# EAGLE design untitled (EAGLE 7.2.0)
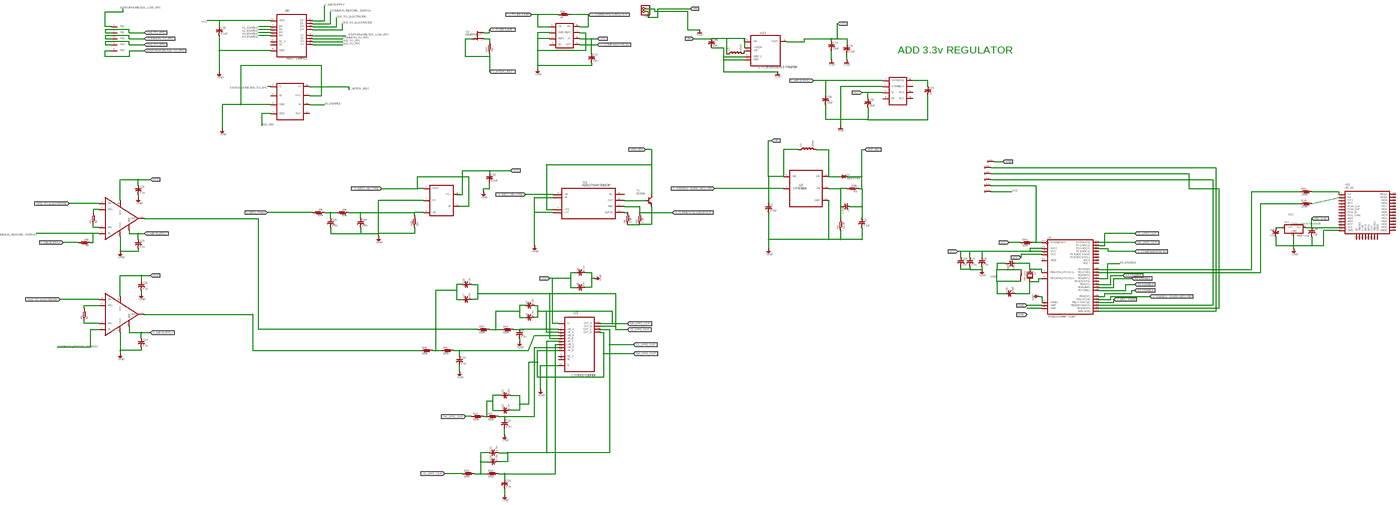
[diagram p0: schematic, sheet 1, overview]
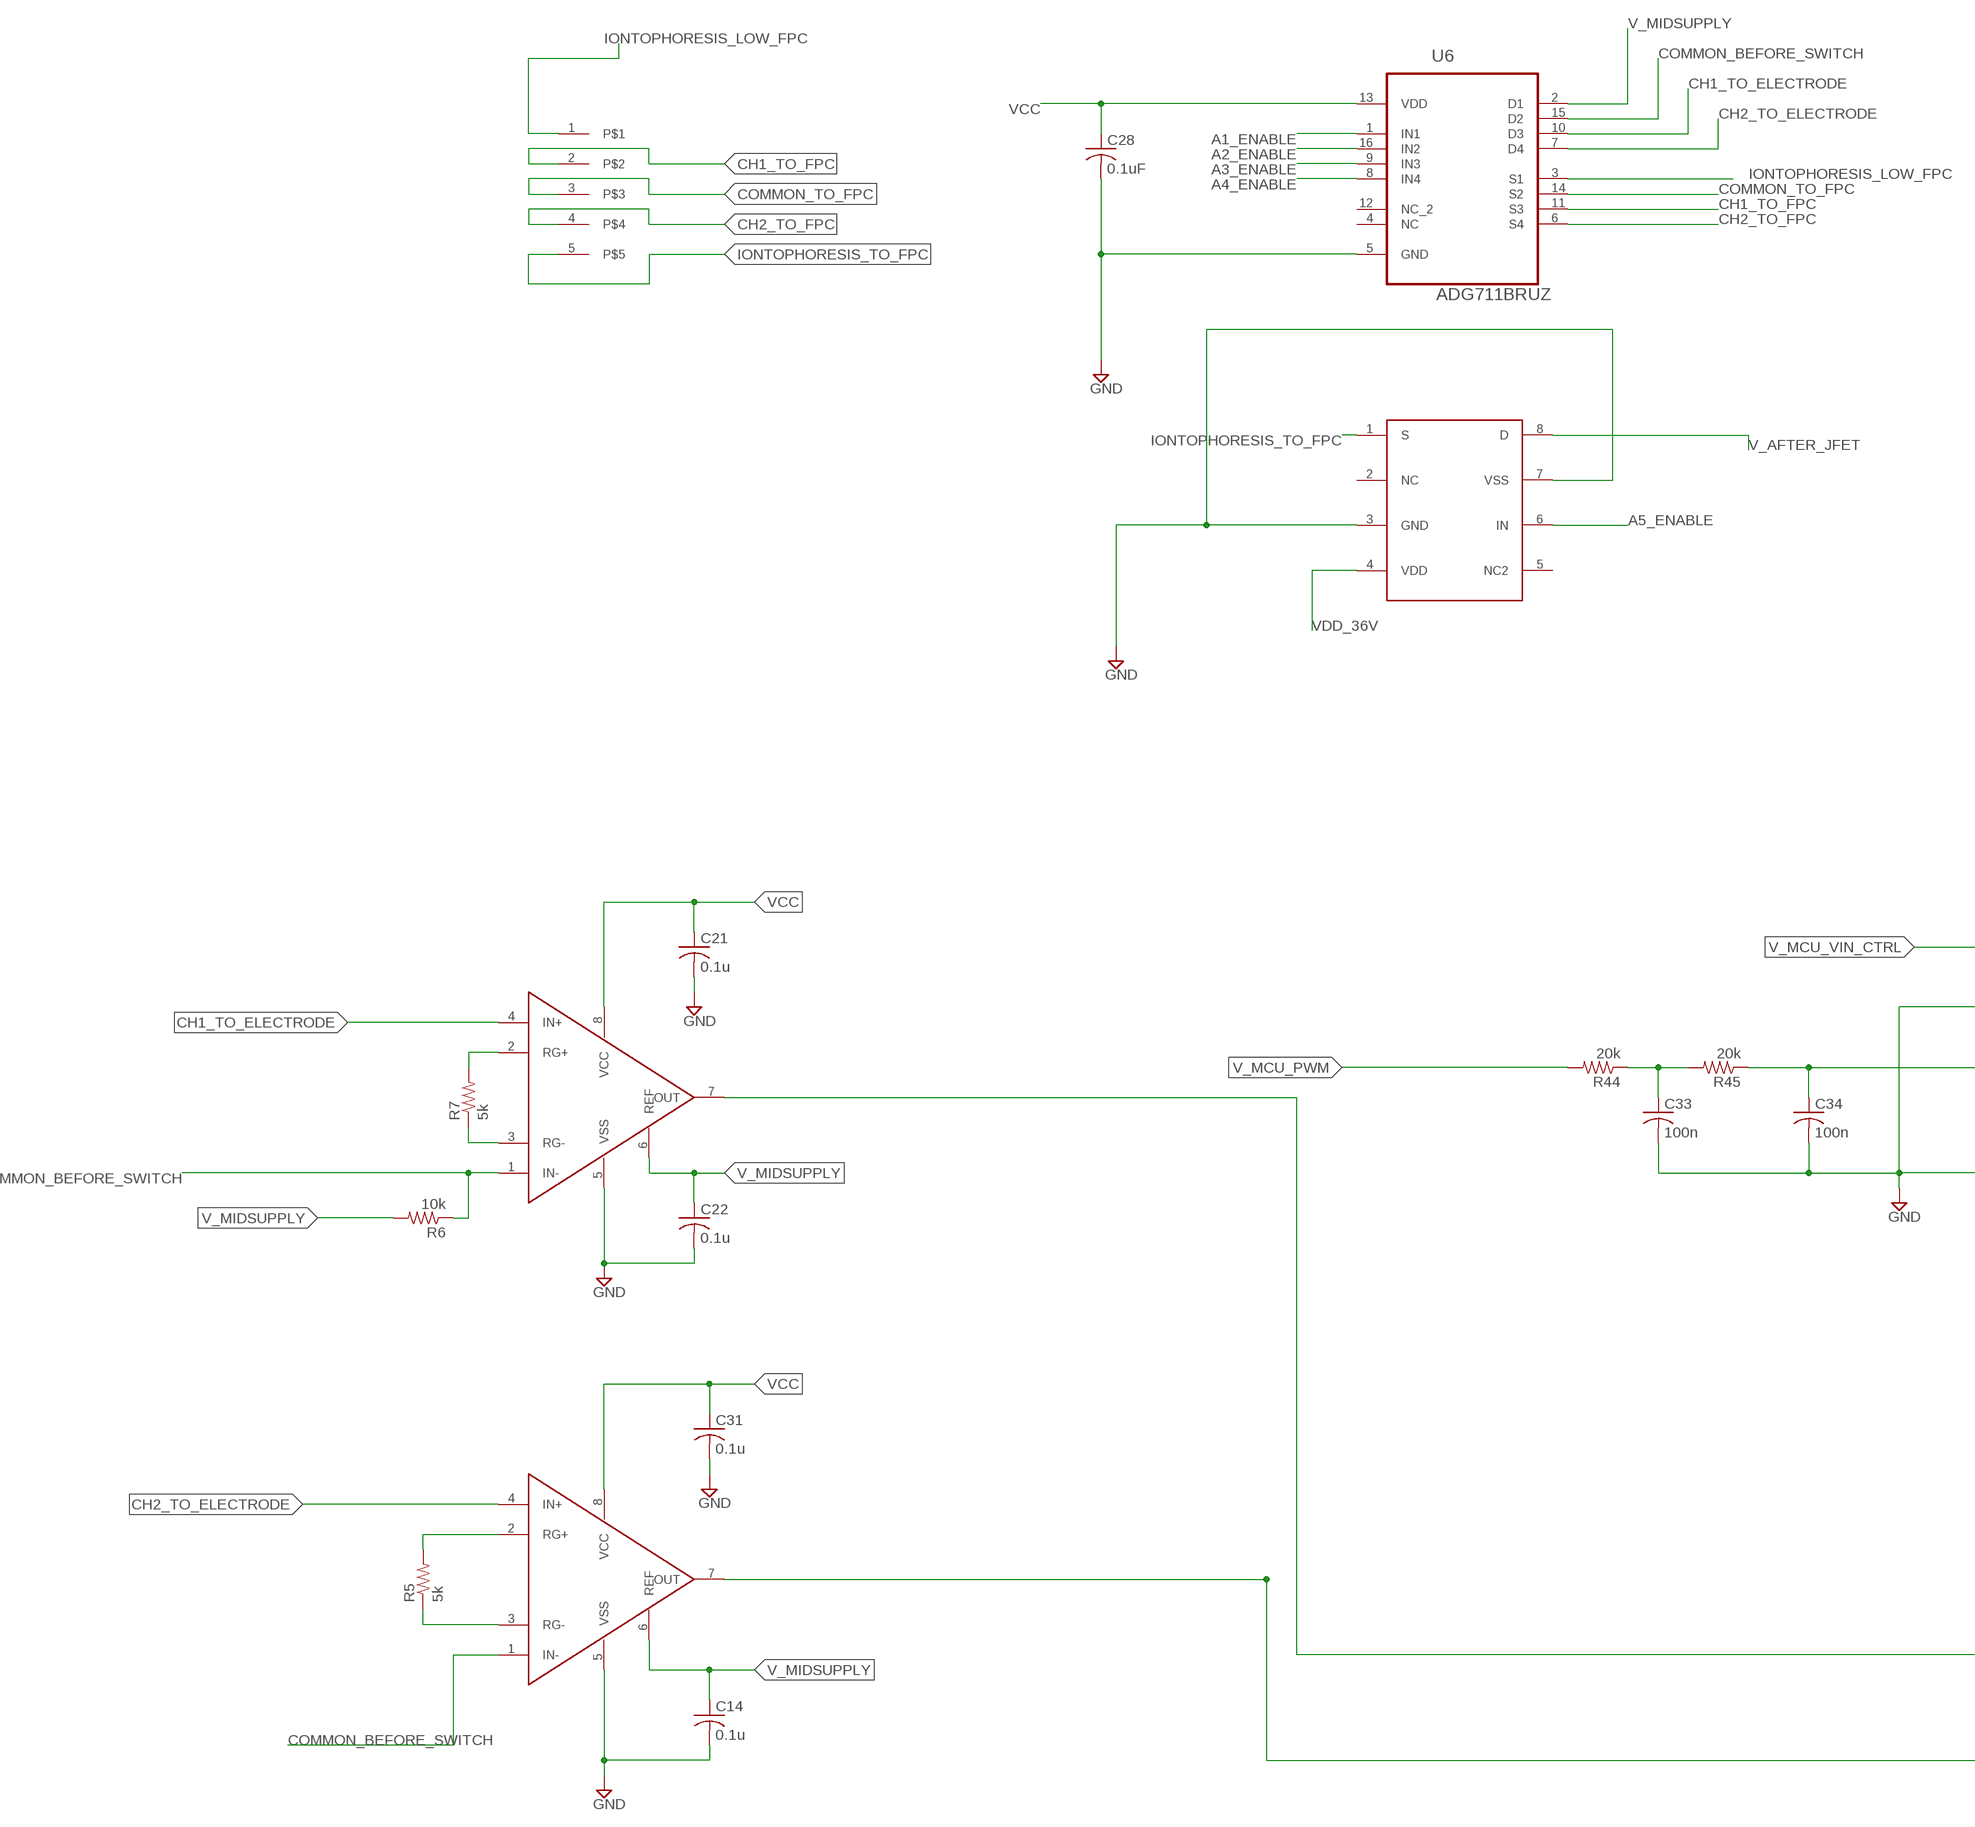
[diagram p1: schematic, sheet 1, part 1 of 4]
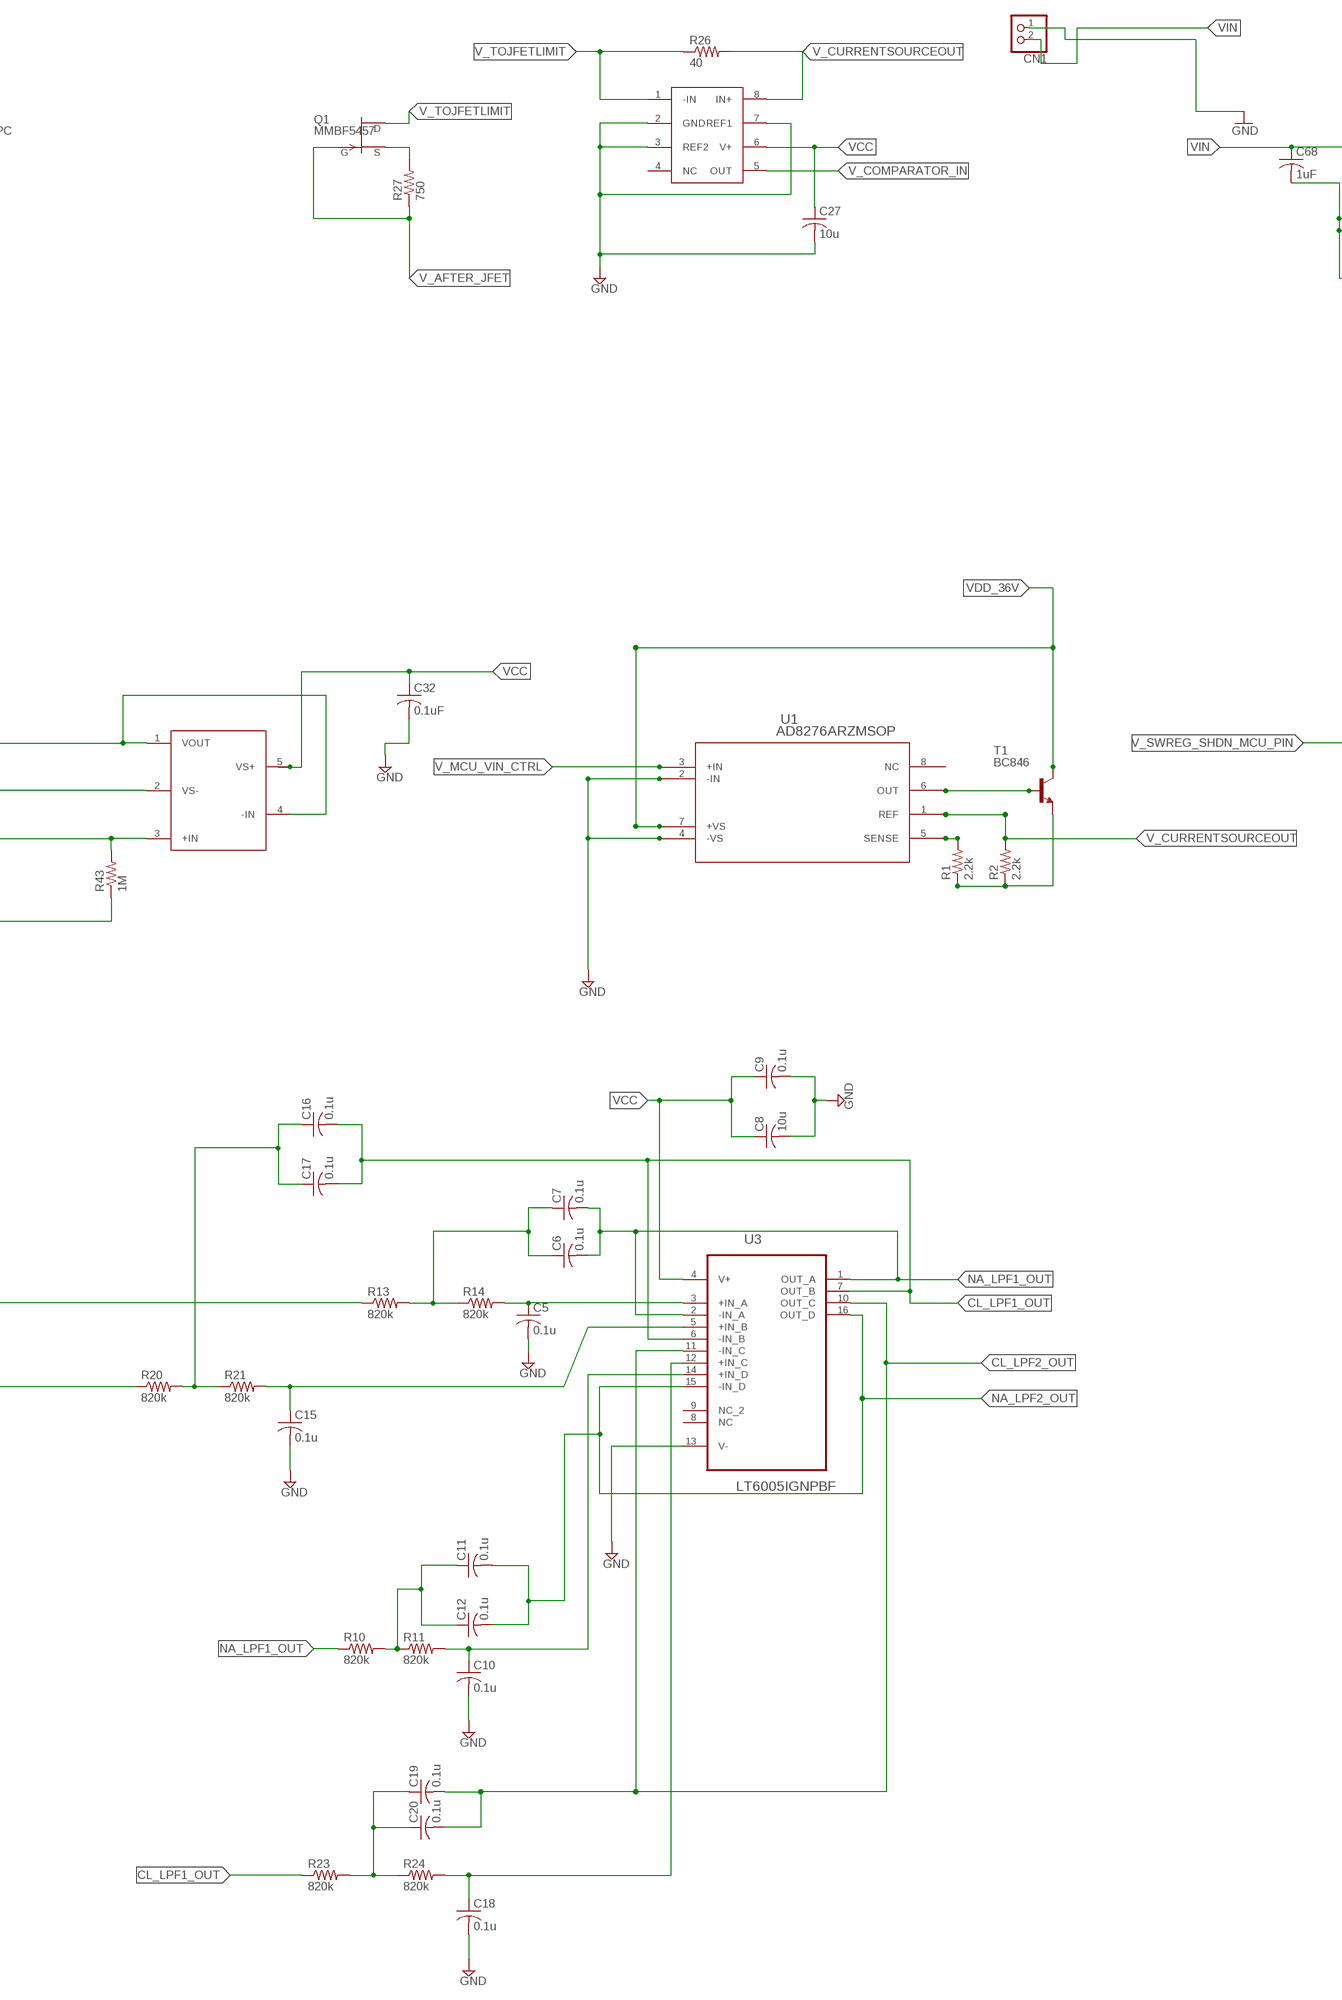
[diagram p2: schematic, sheet 1, part 2 of 4]
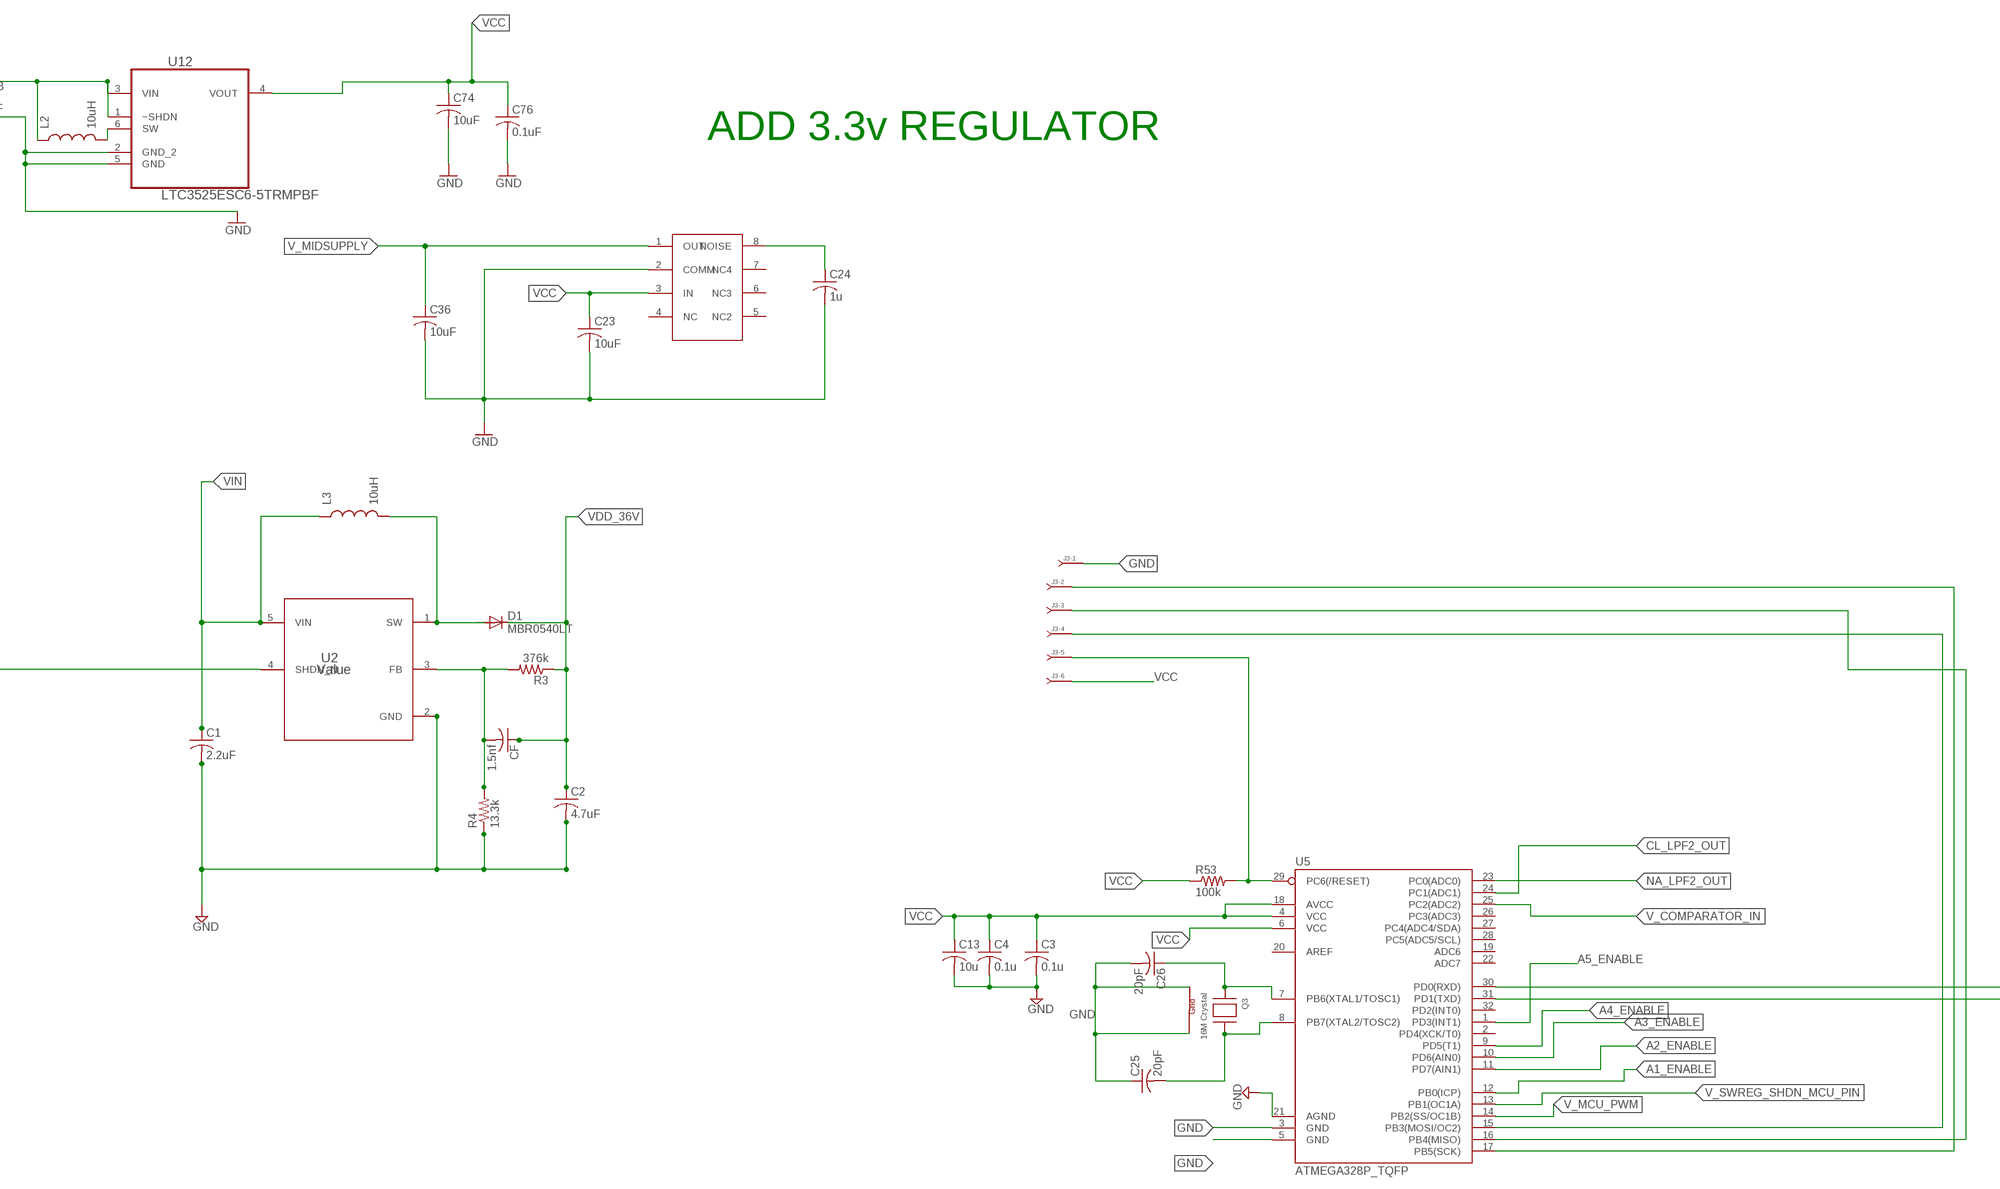
[diagram p3: schematic, sheet 1, part 3 of 4]
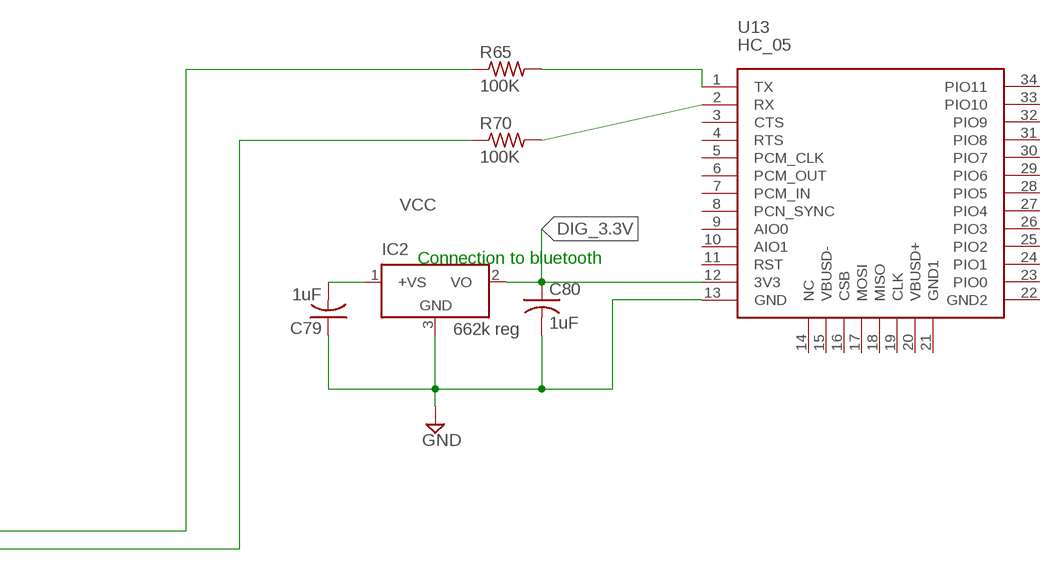
[diagram p4: schematic, sheet 1, part 4 of 4]

## Parts
C1  2.2uF  C-USC0402  [C0402]
C2  4.7uF  C-USC0603  [C0603]
C3  0.1u  C-USC0201  [C0201]
C4  0.1u  C-USC0201  [C0201]
C5  0.1u  C-USC0201  [C0201]
C6  0.1u  C-USC0201  [C0201]
C7  0.1u  C-USC0201  [C0201]
C8  10u  C-USC0402  [C0402]
C9  0.1u  C-USC0201  [C0201]
C10  0.1u  C-USC0201  [C0201]
C11  0.1u  C-USC0201  [C0201]
C12  0.1u  C-USC0201  [C0201]
C13  10u  C-USC0402  [C0402]
C14  0.1u  C-USC0201  [C0201]
C15  0.1u  C-USC0201  [C0201]
C16  0.1u  C-USC0201  [C0201]
C17  0.1u  C-USC0201  [C0201]
C18  0.1u  C-USC0201  [C0201]
C19  0.1u  C-USC0201  [C0201]
C20  0.1u  C-USC0201  [C0201]
C21  0.1u  C-USC0201  [C0201]
C22  0.1u  C-USC0201  [C0201]
C23  10uF  C-USC0402  [C0402]
C24  1u  C-USC0402  [C0402]
C25  20pF  C-USC0402  [C0402]
C26  20pF  C-USC0402  [C0402]
C27  10u  C-USC0402  [C0402]
C28  0.1uF  C-USC0201  [C0201]
C31  0.1u  C-USC0201  [C0201]
C32  0.1uF  C-USC0201  [C0201]
C33  100n  C-USC0201  [C0201]
C34  100n  C-USC0201  [C0201]
C36  10uF  C-USC0402  [C0402]
C68  1uF  C-USC0402  [C0402]
C74  10uF  C-USC0402  [C0402]
C76  0.1uF  C-USC0402  [C0402]
C79  1uF  C-USC0402  [C0402]
C80  1uF  C-USC0402  [C0402]
CF  1.5nf  C-USC0402  [C0402]
CN1  JST_2PIN-SMT  [JST-PH-2-SMT]
D1  MBR0540LT  [SOD123]
IC2  662k reg  LM50  [SOT23]
J3  J-06-100-2X03  [HDR-100-2X03]
L2  10uH  INDUCTOR0805  [0805]
L3  10uH  INDUCTOR0805  [0805]
Q1  MMBF5457  [SOT23]
Q3  16M Crystal  XTAL-4-3225  [NX3225]
R1  2.2k  R-US_R0201  [R0201]
R2  2.2k  R-US_R0201  [R0201]
R3  376k  R-US_R0402  [R0402]
R4  13.3k  R-US_R0402  [R0402]
R5  5k  R-US_R0201  [R0201]
R6  10k  R-US_R0201  [R0201]
R7  5k  R-US_R0201  [R0201]
R10  820k  R-US_R0201  [R0201]
R11  820k  R-US_R0201  [R0201]
R13  820k  R-US_R0201  [R0201]
R14  820k  R-US_R0201  [R0201]
R20  820k  R-US_R0201  [R0201]
R21  820k  R-US_R0201  [R0201]
R23  820k  R-US_R0201  [R0201]
R24  820k  R-US_R0201  [R0201]
R26  40  R-US_R0201  [R0201]
R27  750  R-US_R0402  [R0402]
R43  1M  R-US_R0201  [R0201]
R44  20k  R-US_R0201  [R0201]
R45  20k  R-US_R0201  [R0201]
R53  100k  R-US_R0201  [R0201]
R65  100K  R-US_R0201  [R0201]
R70  100K  R-US_R0201  [R0201]
T1  BC846  [SOT23]
U1  AD8276ARZMSOP  [MSOP08]
U2  Value  LMR64010XMFE/NOPB  [DBV0005A_N]
U3  LT6005IGNPBF  [SOP63P600X175-16N]
U4  INA282  [SO08]
U5  ATMEGA328P_TQFP  [TQFP32-08]
U6  ADG711BRUZ  [SOP65P640X120-16N]
U7  SOIC8_INAMPMSOP  [MSOP08]
U8  SOIC8_INAMPMSOP  [MSOP08]
U12  LTC3525ESC6-5TRMPBF  [SOT65P210X100-6N]
U13  HC_05  [BLUETOOTH_SMD]
U15  TLE2426IDR  [R_8]
U20  FH12-5S-1SH  [FH12-5S-1SH]
U$1  ADG5401  [MSOP08]
U$5  LT1800  [SOT23-5]

## Nets
A1_ENABLE: U5.12(PB0(ICP)) U6.1(IN1)
A2_ENABLE: U5.11(PD7(AIN1)) U6.16(IN2)
A3_ENABLE: U5.10(PD6(AIN0)) U6.9(IN3)
A4_ENABLE: U5.9(PD5(T1)) U6.8(IN4)
A5_ENABLE: U5.1(PD3(INT1)) U$1.6(IN)
CH1_TO_ELECTRODE: U6.10(D3) U7.4(IN+)
CH1_TO_FPC: U6.11(S3) U20.2
CH2_TO_ELECTRODE: U6.7(D4) U8.4(IN+)
CH2_TO_FPC: U6.6(S4) U20.4
CL_LPF1_OUT: C16.2 C17.2 R23.1 U3.6(-IN_B) U3.7(OUT_B)
CL_LPF2_OUT: C19.2 C20.2 U3.10(OUT_C) U3.11(-IN_C) U5.24(PC1(ADC1))
COMMON_BEFORE_SWITCH: R6.1 U6.15(D2) U7.1(IN-) U8.1(IN-)
COMMON_TO_FPC: U6.14(S2) U20.3
DIG_3.3V: C80.1 IC2.2(VO) U13.12(3V3)
GND: C1.2 C2.2 C3.2 C4.2 C5.2 C8.2 C9.2 C10.2 C13.2 C14.2 C15.2 C18.2 C21.2 C22.2 C23.2 C24.2 C25.1 C26.2 C27.2 C28.2 C31.2 C32.2 C33.2 C34.2 C36.2 C68.2 C74.2 C76.2 C79.1 C80.2 CN1.1 IC2.3(GND) J3.1 Q3.2(G2) Q3.4(G1) R4.1 R43.1 U1.2(-IN) U1.4(-VS) U2.2(GND) U3.13(V-) U4.2(GND) U4.3(REF2) U4.7(REF1) U5.3(GND) U5.5(GND) U5.21(AGND) U6.5(GND) U7.5(VSS) U8.5(VSS) U12.2(GND_2) U12.5(GND) U13.13(GND) U15.2(COMM) U$1.3(GND) U$1.7(VSS) U$5.2(VS-)
IONTOPHORESIS_LOW_FPC: U6.3(S1) U20.1
IONTOPHORESIS_TO_FPC: U20.5 U$1.1(S)
N$1: T1.1(B) U1.6(OUT)
N$2: R13.1 U7.7(OUT)
N$4: R1.2 U1.5(SENSE)
N$6: R1.1 R2.1 T1.2(E)
N$7: R20.1 U8.7(OUT)
N$8: R5.1 U8.3(RG-)
N$9: CF.2 R3.2 R4.2 U2.3(FB)
N$10: R5.2 U8.2(RG+)
N$11: R65.1 U5.30(PD0(RXD))
N$12: C10.1 R11.2 U3.14(+IN_D)
N$13: C5.1 R14.2 U3.3(+IN_A)
N$14: Q1.2(S) R27.2
N$15: C6.1 C7.1 R13.2 R14.1
N$17: C11.1 C12.1 R10.2 R11.1
N$18: R7.1 U7.3(RG-)
N$19: R7.2 U7.2(RG+)
N$23: C24.1 U15.8(NOISE)
N$24: C15.1 R21.2 U3.5(+IN_B)
N$25: C16.1 C17.1 R20.2 R21.1
N$26: C18.1 R24.2 U3.12(+IN_C)
N$27: C19.1 C20.1 R23.2 R24.1
N$28: J3.5 R53.2 U5.29(PC6(/RESET))
N$36: L2.2 U12.6(SW)
N$45: C25.2 Q3.3(X2) U5.8(PB7(XTAL2/TOSC2))
N$49: C34.1 R43.2 R45.1 U$5.3(+IN)
N$52: C33.1 R44.1 R45.2
N$56: C26.1 Q3.1(X1) U5.7(PB6(XTAL1/TOSC1))
N$60: R65.2 U13.1(TX)
N$66: J3.4 U5.15(PB3(MOSI/OC2))
N$67: J3.2 U5.17(PB5(SCK))
N$68: J3.3 U5.16(PB4(MISO))
N$72: R70.1 U5.31(PD1(TXD))
N$97: R70.2 U13.2(RX)
NA_LPF1_OUT: C6.2 C7.2 R10.1 U3.1(OUT_A) U3.2(-IN_A)
NA_LPF2_OUT: C11.2 C12.2 U3.15(-IN_D) U3.16(OUT_D) U5.23(PC0(ADC0))
PIN1: D1.A L3.2 U2.1(SW)
V_AFTER_JFET: Q1.3(G) R27.1 U$1.8(D)
V_COMPARATOR_IN: U4.5(OUT) U5.25(PC2(ADC2))
V_CURRENTSOURCEOUT: R2.2 R26.2 U1.1(REF) U4.8(IN+)
V_MCU_PWM: R44.2 U5.14(PB2(SS/OC1B))
V_MCU_VIN_CTRL: U1.3(+IN) U$5.1(VOUT) U$5.4(-IN)
V_MIDSUPPLY: C14.1 C22.1 C36.1 R6.2 U6.2(D1) U7.6(REF) U8.6(REF) U15.1(OUT)
V_SWREG_SHDN_MCU_PIN: U2.4(SHDN_N) U5.13(PB1(OC1A))
V_TOJFETLIMIT: Q1.1(D) R26.1 U4.1(-IN)
VCC: C3.1 C4.1 C8.1 C9.1 C13.1 C21.1 C23.1 C27.1 C28.1 C31.1 C32.1 C74.1 C76.1 C79.2 IC2.1(+VS) J3.6 R53.1 U3.4(V+) U4.6(V+) U5.4(VCC) U5.6(VCC) U5.18(AVCC) U6.13(VDD) U7.8(VCC) U8.8(VCC) U12.4(VOUT) U15.3(IN) U$5.5(VS+)
VDD_36V: C2.1 CF.1 D1.C R3.1 T1.3(C) U1.7(+VS) U$1.4(VDD)
VIN: C1.1 C68.1 CN1.2 L2.1 L3.1 U2.5(VIN) U12.1(~SHDN) U12.3(VIN)
Unconnected: U1.8(NC) U3.8(NC) U3.9(NC_2) U4.4(NC) U5.2(PD4(XCK/T0)) U5.19(ADC6) U5.20(AREF) U5.22(ADC7) U5.26(PC3(ADC3)) U5.27(PC4(ADC4/SDA)) U5.28(PC5(ADC5/SCL)) U5.32(PD2(INT0)) U6.4(NC) U6.12(NC_2) U13.3(CTS) U13.4(RTS) U13.5(PCM_CLK) U13.6(PCM_OUT) U13.7(PCM_IN) U13.8(PCN_SYNC) U13.9(AIO0) U13.10(AIO1) U13.11(RST) U13.14(NC) U13.15(VBUSD-) U13.16(CSB) U13.17(MOSI) U13.18(MISO) U13.19(CLK) U13.20(VBUSD+) U13.21(GND1) U13.22(GND2) U13.23(PIO0) U13.24(PIO1) U13.25(PIO2) U13.26(PIO3) U13.27(PIO4) U13.28(PIO5) U13.29(PIO6) U13.30(PIO7) U13.31(PIO8) U13.32(PIO9) U13.33(PIO10) U13.34(PIO11) U15.4(NC) U15.5(NC2) U15.6(NC3) U15.7(NC4) U$1.2(NC) U$1.5(NC2)

## Notes on the sheet
- ADD 3.3v REGULATOR
- Connection to bluetooth

## Library data of the parts
C1-C22 C27 C28 C31-C34 CF = resistor:C-US: CAPACITOR, American symbol
C23-C26 C36 C74 C76 = adafruit:C-US: CAPACITOR, American symbol; OC_NEWARK: unknown
C68 C79 C80 = adafruit:C-US: CAPACITOR, American symbol; MPN: MC0402X105M6R3CT; OC_NEWARK: 06R4879
CN1 = adafruit:JST_2PIN: JST 2-Pin Connectors of various flavors SMT-RA (S2B-PH-SM4) 4UConnector #17311 SMT (B2B-PH-SM4) THM-RA (S2B-PH) THM (B2B-PH)
D1 = eric-custom:MBR0540LT: SCHOTTKY BARRIER RECTIFIER
IC2 = linear:LM50: SOT-23 Single-Supply Centigrade Temperature Sensor Vout = (10mV/°C x Temp °C) +5mmmV Source: http://cache.national.com/ds/LM/LM50.pdf; MF: NATIONAL SEMICONDUCTOR; MPN: LM5008MM/NOPB; OC_NEWARK: 41K6028
J3 = con-headers-jp:J-06-: HEADER JACK PINS
L2 L3 = SparkFun-Passives:INDUCTOR: Inductors Basic Inductor/Choke - 0603 and 1206. Footprints are not proven and vary greatly between part numbers. SRN6045- 33uH, 20% 1.4A SDR0403-560KL - 56uH, 10%, 500mA RMS/740mA peak; OC_NEWARK: unknown
Q1 = eric-custom:MMBF5457: MMBF5457 N-JFET
Q3 = adafruit:XTAL-4: Classic 4-pin 3.2 x 2.5mm crystal; OC_NEWARK: unknown
R1-R7 R10 R11 R13 R14 R20 R21 R23 R24 R26 R27 R43-R45 = resistor:R-US_: RESISTOR, American symbol
R53 R65 R70 = resistor:R-US_: RESISTOR, American symbol; OC_NEWARK: unknown
T1 = transistor:BC846: NPN TRANSISTOR
U1 = eric-custom:AD8276ARZ
U2 = eric-custom:LMR64010XMFE/NOPB; COMPTYPE: IC; MANUFACTURER: Texas Instruments; MOUNTTYPE: SMT; PACKAGEREFERENCE: DBV0005A; PARTNUMBER: LMR64010XMFE/NOPB; PIN_COUNT: 5; REFDES: RefDes; ROHS: Y; TYPE: TYPE
U3 = LTC_By_element14_Batch_1:LT6005IGNPBF: Op Amps; MPN: LT6005IGN#PBF; OC_FARNELL: 1432099; OC_NEWARK: 57M8943; PACKAGE: SSOP-16; SUPPLIER: Linear Technology
U4 = eric-custom:INA282
U5 = SparkFun-DigitalIC:ATMEGA328P_TQFP; PROD_ID: IC-09069
U6 = Analog Devices_By_element14_Batch_1:ADG711BRUZ: CMOS Low Voltage 4Quad SPST Switches; MPN: ADG711BRUZ; OC_FARNELL: 1838886; OC_NEWARK: 19M8667; PACKAGE: TSSOP-16; SUPPLIER: Analog Devices
U7 U8 = eric-custom:SOIC8_INAMP: Generic single supply instrumentation amplifier for SO8 package. Based off of AD8221 inamp package
U12 = LTC_By_element14_Batch_1:LTC3525ESC6-5TRMPBF: Step-Up DC/DC Converter; OC_FARNELL: 1663905; OC_NEWARK: unknown; PACKAGE: SC70-6; SUPPLIER: LINEAR TECHNOLOGY
U13 = Bluetooth HC-05:HC_05: HC-05 Bluetooth Module; OC_NEWARK: unknown
U15 = eric-custom:TLE2426IDR: TLE2426 Rail splitter
U20 = eric-custom:FH12-5S-1SH: 1mm pitch FPC connector, 5pin
U$1 = eric-custom:ADG5401
U$5 = eric-custom:LT1800: 80MHz, 25V/µs Low Power Rail-to-Rail Input and Output Precision Op Amp

## Board
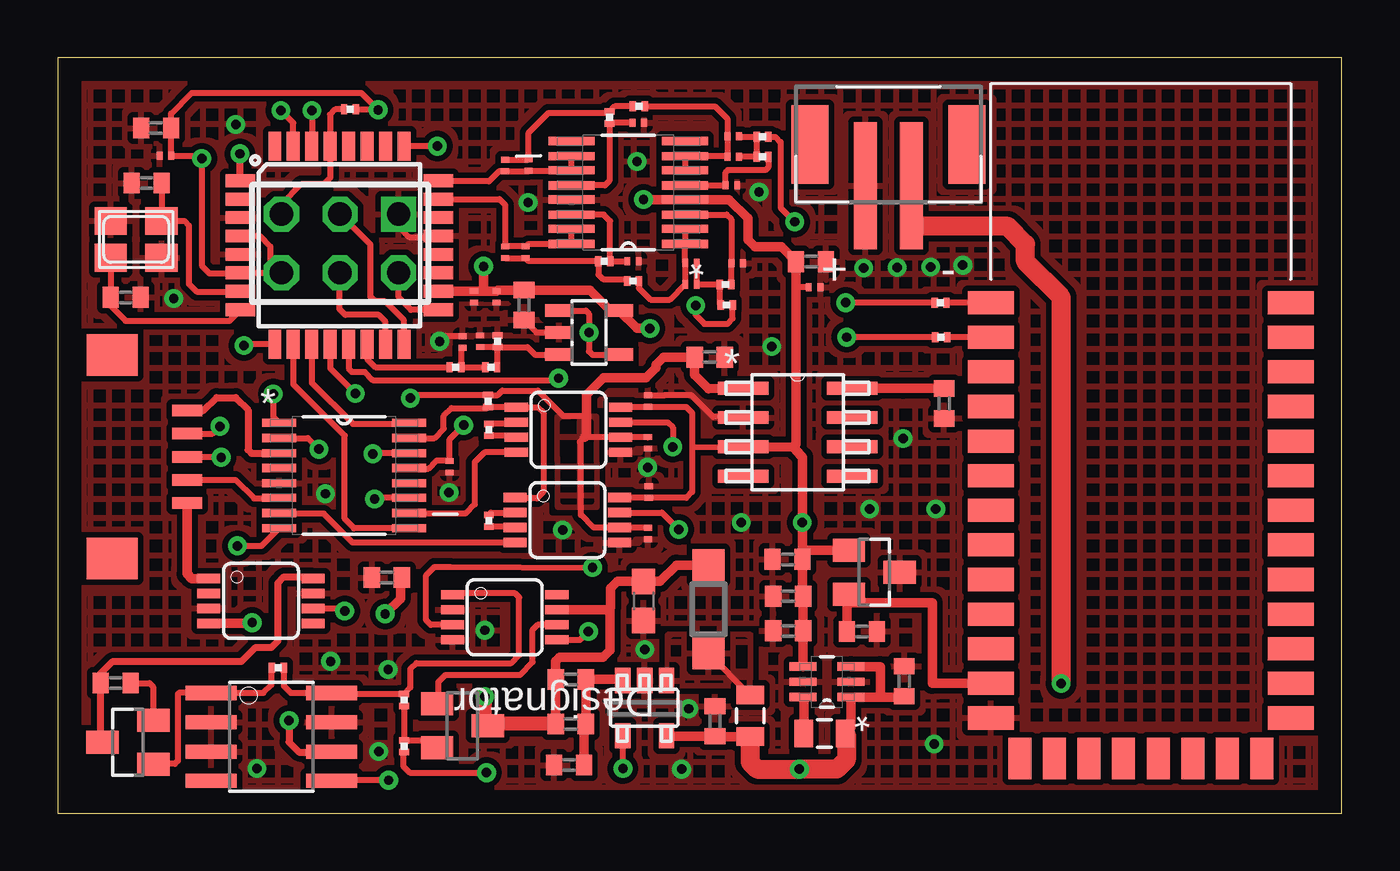
[diagram p5: board, top side]
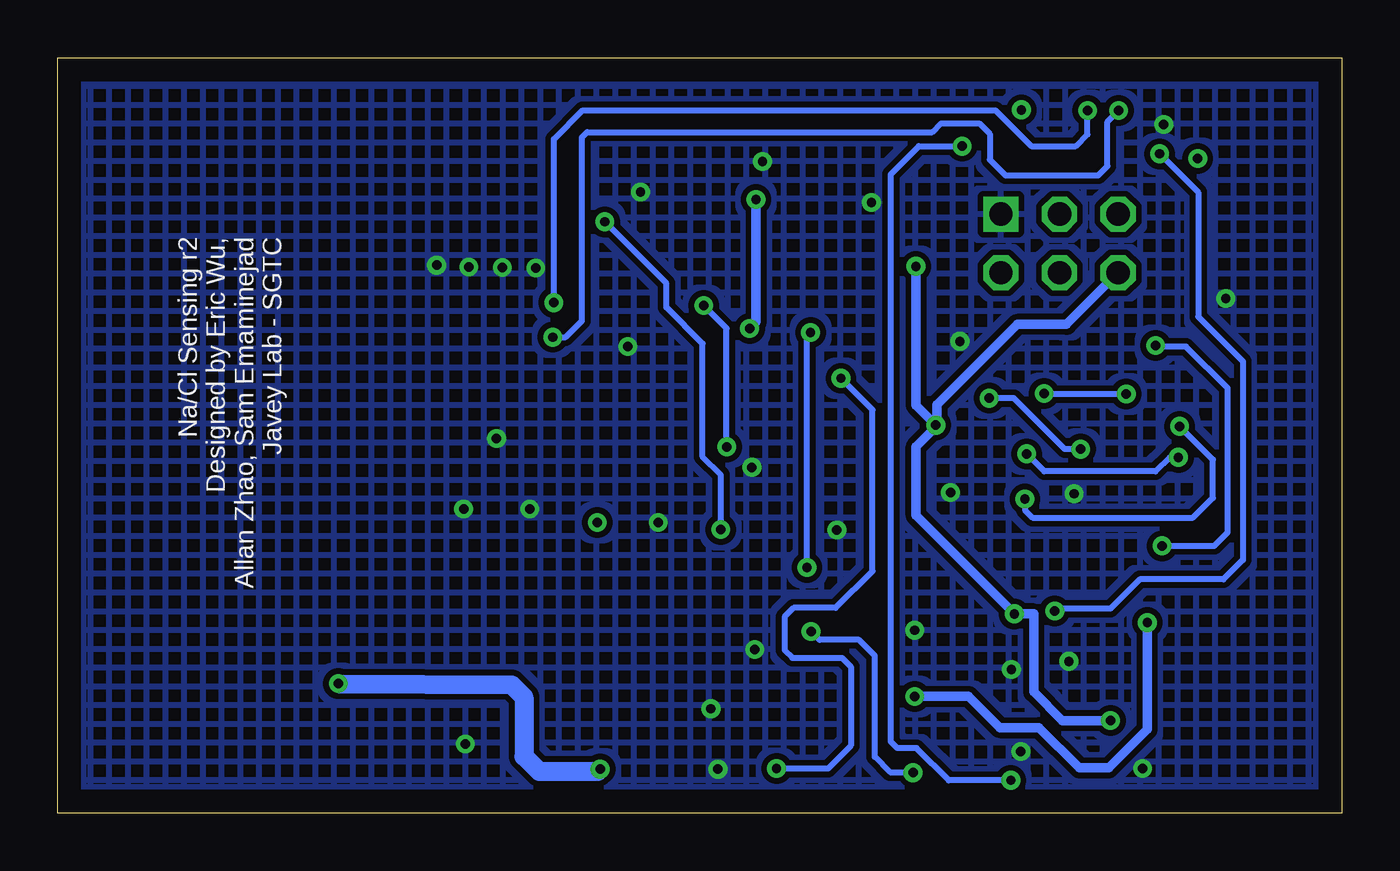
[diagram p6: board, bottom side, seen from below]

Size 55.68 x 32.74 mm. Coordinates in mm from the lower left corner, seen from the top.
Outline: 0,0 55.68,0 55.68,32.74 0,32.74 0,0
Copper layers (1*16): Top 0.035mm / dielectric 1.5mm / Bottom 0.035mm
Design rules "default *": minimum track width 10mil, minimum drill 15mil, track to track 8mil, track to pad 8mil, pad to pad 8mil, via to via 8mil, smd to smd 8mil, copper to edge 40mil, drill to drill 8mil, minimum pad ring 10mil, minimum via ring 8mil, stop-mask expansion 4mil, vias tented up to drill 0mil, thermal gap 10mil

### Footprints (pad centres in the part's own frame; a part is rotated, then mirrored left to right if it is on the bottom)
C0402 = smd 0.7 x 0.9: 1 -0.65,0; 2 0.65,0
C0603 = smd 1.1 x 1: 1 -0.85,0; 2 0.85,0
C0201 = smd 0.25 x 0.35: 1 -0.25,0; 2 0.25,0
JST-PH-2-SMT = smd 1 x 5.5: 1 -1,-1.8; 2 1,-1.8 | smd 1.6 x 3.4: NC1 -3.4,0; NC2 3.4,0
SOD123 = smd 1.4 x 1.4: A 1.9,0; C -1.9,0
SOT23 = smd 1 x 1.4: 1 -0.95,-1.1; 2 0.95,-1.1; 3 0,1.1
HDR-100-2X03 = drill 1.016 square: 1 -2.54,-1.27 | drill 1.016 octagon: 2 -2.54,1.27; 3 0,-1.27; 4 0,1.27; 5 2.54,-1.27; 6 2.54,1.27
0805 = smd 0.8 x 1.2: 1 -0.9,0; 2 0.9,0
NX3225 = smd 1.4 x 1.2: 1 -1.1,-0.8; 2 1.1,-0.8; 3 1.1,0.8; 4 -1.1,0.8
R0201 = smd 0.28 x 0.43: 1 -0.255,0; 2 0.255,0
R0402 = smd 0.7 x 0.9: 1 -0.65,0; 2 0.65,0
MSOP08 = smd 0.4 x 1: 1 -0.976,-2.263; 2 -0.326,-2.263; 3 0.324,-2.263; 4 0.974,-2.263; 5 0.974,2.262; 6 0.324,2.262; 7 -0.326,2.262; 8 -0.976,2.262
DBV0005A_N = smd 1.092 x 0.66: 1 -1.2,0.95; 2 -1.2,0; 3 -1.2,-0.95; 4 1.2,-0.95; 5 1.2,0.95
SOP63P600X175-16N = smd 1.981 x 0.356: 1 -2.464,2.235; 2 -2.464,1.575; 3 -2.464,0.965; 4 -2.464,0.305; 5 -2.464,-0.305; 6 -2.464,-0.965; 7 -2.464,-1.575; 8 -2.464,-2.235; 9 2.464,-2.235; 10 2.464,-1.575; 11 2.464,-0.965; 12 2.464,-0.305; 13 2.464,0.305; 14 2.464,0.965; 15 2.464,1.575; 16 2.464,2.235
SO08 = smd 0.61 x 2.21: 1 -1.905,-2.616; 2 -0.635,-2.616; 3 0.635,-2.616; 4 1.905,-2.616; 5 1.905,2.616; 6 0.635,2.616; 7 -0.635,2.616; 8 -1.905,2.616
TQFP32-08 = smd 1.27 x 0.559: 1 -4.293,2.8; 2 -4.293,2; 3 -4.293,1.2; 4 -4.293,0.4; 5 -4.293,-0.4; 6 -4.293,-1.2; 7 -4.293,-2; 8 -4.293,-2.8; 17 4.293,-2.8; 18 4.293,-2; 19 4.293,-1.2; 20 4.293,-0.4; 21 4.293,0.4; 22 4.293,1.2; 23 4.293,2; 24 4.293,2.8 | smd 0.559 x 1.27: 9 -2.8,-4.293; 10 -2,-4.293; 11 -1.2,-4.293; 12 -0.4,-4.293; 13 0.4,-4.293; 14 1.2,-4.293; 15 2,-4.293; 16 2.8,-4.293; 25 2.8,4.293; 26 2,4.293; 27 1.2,4.293; 28 0.4,4.293; 29 -0.4,4.293; 30 -1.2,4.293; 31 -2,4.293; 32 -2.8,4.293
SOP65P640X120-16N = smd 1.473 x 0.356: 1 -2.819,2.286; 2 -2.819,1.626; 3 -2.819,0.965; 4 -2.819,0.33; 5 -2.819,-0.33; 6 -2.819,-0.965; 7 -2.819,-1.626; 8 -2.819,-2.286; 9 2.819,-2.286; 10 2.819,-1.626; 11 2.819,-0.965; 12 2.819,-0.33; 13 2.819,0.33; 14 2.819,0.965; 15 2.819,1.626; 16 2.819,2.286
SOT65P210X100-6N = smd 1.168 x 0.356: 1 -1.041,0.66; 2 -1.041,0; 3 -1.041,-0.66; 4 1.041,-0.66; 5 1.041,0; 6 1.041,0.66
BLUETOOTH_SMD = smd 2 x 1: 1 -6.35,3.81; 2 -6.35,2.31; 3 -6.35,0.81; 4 -6.35,-0.69; 5 -6.35,-2.19; 6 -6.35,-3.69; 7 -6.35,-5.19; 8 -6.35,-6.69; 9 -6.35,-8.19; 10 -6.35,-9.69; 11 -6.35,-11.19; 12 -6.35,-12.69; 13 -6.35,-14.19; 22 6.65,-14.19; 23 6.65,-12.69; 24 6.65,-11.19; 25 6.65,-9.69; 26 6.65,-8.19; 27 6.65,-6.69; 28 6.65,-5.19; 29 6.65,-3.69; 30 6.65,-2.19; 31 6.65,-0.69; 32 6.65,0.81; 33 6.65,2.31; 34 6.65,3.81 | smd 1 x 1.8: 14 -5.1,-15.94; 15 -3.6,-15.94; 16 -2.1,-15.94; 17 -0.6,-15.94; 18 0.9,-15.94; 19 2.4,-15.94; 20 3.9,-15.94; 21 5.4,-15.94
R_8 = smd 2.184 x 0.559: 1 -2.362,1.905; 2 -2.362,0.635; 3 -2.362,-0.635; 4 -2.362,-1.905; 5 2.362,-1.905; 6 2.362,-0.635; 7 2.362,0.635; 8 2.362,1.905
FH12-5S-1SH = smd 0.5 x 1.3: 1 2,-1.8; 2 1,-1.8; 3 0,-1.8; 4 -1,-1.8; 5 -2,-1.8 | smd 1.8 x 2.2: P$1 -4.41,1.45; P$2 4.41,1.45
SOT23-5 = smd 0.55 x 1.2: 1 -0.95,-1.3; 2 0,-1.3; 3 0.95,-1.3; 4 0.95,1.3; 5 -0.95,1.3

### Placement (x,y rotation side)
C1  28.5,3.99 90 top
C2  25.4,9.19 270 top
C3  19.02,22.38 270 top
C4  4.67,28.5 180 top
C5  29.46,23.83 0 top
C6  27.46,22.91 180 top
C7  27.46,23.85 180 top
C8  32.66,23.9 0 top
C9  32.82,22.78 0 top
C10  24.94,23.93 0 top
C11  20.29,24.31 90 top
C12  19.41,24.31 90 top
C13  4.27,29.69 180 top
C14  25.6,16.05 270 top
C15  29.21,27.2 0 top
C16  29.29,28.45 180 top
C17  29.29,29.34 180 top
C18  25.17,29.92 0 top
C19  19.41,28.07 270 top
C20  20.42,28.09 270 top
C21  25.63,13.92 90 top
C22  25.6,12.12 270 top
C23  20.22,22.02 270 top
C24  38.43,17.75 270 top
C25  2.95,22.35 180 top
C26  3.86,27.3 180 top
C27  14.27,10.21 180 top
C28  16.99,15.01 270 top
C31  25.6,17.86 90 top
C32  18.06,22.38 270 top
C33  17.55,20.42 90 top
C34  18.31,20.45 90 top
C36  28.27,19.76 0 top
C68  36.7,5.71 90 top
C74  31.67,9.4 180 top
C76  31.67,7.9 180 top
C79  31.65,11 0 top
C80  34.87,7.87 0 top
CF  22.25,3.86 0 top
CN1  36.02,28.98 0 top
D1  28.22,8.84 270 top
IC2  35.41,10.44 270 top
J3  12.24,24.69 180 top
L2  33.25,3.45 180 top
L3  30.02,4.22 90 top
Q1  3.05,3.07 90 top
Q3  3.4,24.87 180 top
R1  15.01,2.9 270 top
R2  15.01,4.9 90 top
R3  22.25,5.79 0 top
R4  22.17,2.08 0 top
R5  18.69,12.67 90 top
R6  18.67,17.86 90 top
R7  18.69,16.61 90 top
R10  24.94,23.06 180 top
R11  23.7,23.93 0 top
R13  29.01,22.02 180 top
R14  28.96,22.91 0 top
R20  30.56,29.31 180 top
R21  30.56,28.45 0 top
R23  25.2,30.63 180 top
R24  23.93,30.15 270 top
R26  9.55,6.3 0 top
R27  2.51,5.64 0 top
R43  19.08,20.45 270 top
R44  17.25,19.33 180 top
R45  18.8,19.33 180 top
R53  12.67,30.51 180 top
R65  38.28,22.12 0 top
R70  38.3,20.62 0 top
T1  17.55,3.78 270 top
U1  19.38,8.48 270 top
U2  25.45,4.55 270 top
U3  24.74,26.9 180 top
U4  9.27,3.3 270 top
U5  12.22,24.61 0 top
U6  12.42,14.63 0 top
U7  22.15,16.61 270 top
U8  22.1,12.7 270 top
U12  33.35,5.69 180 top
U13  46.81,18.31 0 top
U15  32.08,16.51 0 top
U20  3.81,15.44 90 top
U$1  8.81,9.19 270 top
U$5  23.04,20.83 270 top

### Tracks (layer width: path | path; a pad name or v marks a point on that pad's centre or on a via)
A1_ENABLE  (via drill 0.41)
  Top 0.254: U5.12 11.82,19.27 v12.9,18.19 | v9.35,18.16 9.35,17.17 U6.1
  Bottom 0.254: v9.35,18.16 12.88,18.16 v12.9,18.19
A2_ENABLE
  Top 0.254: U5.11 11.02,18.65 12.8,16.87 15.19,16.87 U6.16
  Top 0.305: 15.21,16.89 U6.16
A3_ENABLE
  Top 0.254: U5.10 10.22,18.59 12.45,16.36 12.45,12.75 12.85,12.34 U6.9
A4_ENABLE  (via drill 0.41)
  Top 0.254: U5.9 8.13,20.32 v8.08,20.27 | v7.8,11.58 8.84,11.58 U6.8
  Bottom 0.254: v7.8,11.58 5.54,11.58 4.95,12.17 4.95,18.41 6.76,20.22 8.03,20.22 v8.08,20.27
A5_ENABLE  (via drill 0.41)
  Top 0.254: U$1.6 12.34,8.87 v12.45,8.76
  Top 0.305: v7.9,28.57 7.9,27.44 U5.1
  Bottom 0.254: v7.9,28.57 6.22,26.9 6.22,21.51 4.29,19.58 4.29,10.97 5.13,10.13 8.76,10.13 10.03,8.86 12.34,8.86 v12.45,8.76
CH1_TO_ELECTRODE
  Top 0.254: U7.4 18.51,15.64 18.08,15.21 18.08,13.39 17.68,12.98 15.27,12.98 U6.10
CH1_TO_FPC  (via drill 0.41)
  Top 0.254: U20.2 6.71,16.44 v7.04,16.76 | U6.11 13.79,13.66 v13.74,13.61
  Bottom 0.254: v13.74,13.61 13.74,13.13 13.41,12.8 6.45,12.8 5.59,13.66 5.59,15.32 v7.04,16.76
CH2_TO_ELECTRODE
  Top 0.254: U8.4 12.78,11.73 11.53,12.98 9.63,12.98 U6.7
CH2_TO_FPC
  Top 0.254: U20.4 7.71,14.44 8.51,13.64 9.58,13.64 U6.6
CL_LPF1_OUT
  Top 0.254: U3.6 U3.7 29.01,28.47 C16.2 C17.2 29.03,30.1 28.5,30.63 R23.1
CL_LPF2_OUT
  Top 0.254: U3.10 U3.11 22.25,27.84 C20.2 20.4,27.82 C19.2 19.13,27.82 18.69,27.38 16.54,27.38 U5.24
COMMON_BEFORE_SWITCH
  Top 0.254: 19.83,13.71 U8.1 19.87,13.64 20.78,13.64 21.06,13.92 21.06,17.35 20.82,17.59 U7.1 R6.1 18.62,17.55 17.07,17.55 16.74,17.22 16.74,16.66 16.33,16.26 U6.15
COMMON_TO_FPC  (via drill 0.41)
  Top 0.254: U6.14 13.69,15.6 v13.66,15.57 | U20.3 7.06,15.44 v7.09,15.42
  Bottom 0.254: v7.09,15.42 7.47,15.42 8.08,14.81 12.9,14.81 v13.66,15.57
DIG_3.3V
  Top 0.406: IC2.2 34.22,9.49 34.22,9.12 | 34.22,9.12 C80.1 | U13.12 37.92,5.62 37.92,9.12 34.22,9.12
GND  (via drill 0.41)
  Top 0.254: U$5.2 20.76,20.83 C23.2 | C31.2 26.28,18.11 26.29,18.11 27.48,18.11 28.42,17.17 29.41,17.17 29.36,17.12 U15.2 | C33.2 16.79,20.67 v16.56,20.45 | J3.1 14.78,25.43 15.24,24.97 16.47,24.97 U5.21
  other vias: 18.52,7.92 20.4,26.47 38,3 21.89,12.27 35.2,13.18 25.58,14.99 8.64,1.93 34.95,23.62 36.4,23.65 37.85,23.67 39.24,23.75 14.33,6.22 30.96,20.22 11.84,6.58 30.4,26.92 7.72,29.85 5.03,22.3 27.36,4.52 25.45,7.09 27.05,1.91 29.64,12.6 38.07,13.18 25.12,28.24 36.65,16.23 13.92,2.67 16.97,13.89 11.61,13.84
  pour Bottom (isolate 0.254, hatched): -0.03,32.74 0.05,0.48 57.02,0.3 57.05,32.18
  pour Top (isolate 0.254, rank 2, hatched): 0.18,32.33 0.15,0.58 56.87,0.41 56.82,31.83
IONTOPHORESIS_LOW_FPC
  Top 0.254: 9.58,15.62 U6.3
  Top 0.305: U20.1 6.32,17.44 6.88,18.01 7.72,18.01 8.25,17.47 8.25,15.75 8.41,15.6 U6.3
IONTOPHORESIS_TO_FPC
  Top 0.406: U20.5 5.61,10.37 5.82,10.16 U$1.1
N$1
  Top 0.254: T1.1 16.51,4.93 16.51,5.67 16.5,5.68 16.81,5.99 20.04,5.99 20.6,6.55 20.6,7.95 20.81,8.16 U1.6
N$2  (via drill 0.41)
  Top 0.254: U7.7 26.45,16.94 26.67,16.71 v26.67,15.87 | v27.66,22 27.66,21.59 28.04,21.21 29.03,21.21 29.26,21.44 R13.1
  Bottom 0.254: v26.67,15.87 26.67,21.01 v27.66,22
N$4  (via drill 0.41)
  Top 0.254: U1.5 22.65,7.51 v23.01,7.87 | v18.59,1.75 15.27,1.75 14.99,2.03 14.99,2.61 R1.2
  Bottom 0.254: v18.59,1.75 18.62,1.78 19.58,1.78 20.24,2.44 20.24,6.82 20.93,7.51 22.65,7.51 v23.01,7.87
N$6
  Top 0.254: 16.41,3.12 T1.2 | 16.16,3.12 T1.2 | R2.1 R1.1 16.14,3.15 T1.2
N$7  (via drill 0.41)
  Top 0.254: U8.7 26.19,13.03 v26.92,12.29 | R20.1 31.11,29.31 31.34,29.08 31.34,26.24 v31.95,25.63
  Bottom 0.254: v26.92,12.29 26.92,14.66 27.71,15.44 27.71,20.35 29.29,21.92 29.29,22.96 v31.95,25.63
N$8
  Top 0.254: U8.3 19.79,12.42 R5.1
N$9
  Top 0.406: R4.2 22.82,3.78 CF.2 R3.2 24.46,5.79 U2.3
N$10
  Top 0.254: R5.2 18.79,13.03 U8.2
N$11  (via drill 0.41)
  Top 0.254: R65.1 v34.16,22.12 | v11.02,30.45 U5.30
  Bottom 0.254: v34.16,22.12 34.16,29.21 32.92,30.45 15.01,30.45 13.46,28.9 11.53,28.9 11.02,29.41 v11.02,30.45
N$12
  Top 0.254: U3.14 23.67,25.93 23.95,25.65 R11.2 C10.1
N$13
  Top 0.254: R14.2 C5.1 29.21,25.73 29.01,25.93 U3.3
N$14
  Top 0.254: R27.2 3.99,5.64 4.14,5.49 Q1.2
N$15
  Top 0.254: C7.1 C6.1 R14.1 28.7,22.07 R13.2
N$17
  Top 0.254: C12.1 C11.1 20.43,23.93 R11.1 23.44,23.34 23.65,23.14 24.61,23.14 R10.2
N$18
  Top 0.254: U7.3 19.82,16.36 R7.1
N$19
  Top 0.254: U7.2 19.81,16.87 R7.2
N$23
  Top 0.406: C24.1 36.66,18.4 U15.8
N$24
  Top 0.254: U3.5 C15.1 28.96,27.77 29.06,27.86 30.68,27.86 30.81,27.99 R21.2
N$25
  Top 0.254: C17.1 29.56,29.31 R20.2 R21.1 C16.1
N$26
  Top 0.254: U3.12 23.72,27.2 23.93,27.41 R24.2 23.95,29.92 C18.1
N$27
  Top 0.254: C19.1 20.4,28.32 C20.1 20.42,29.49 21.28,30.35 23.87,30.35 R24.1 24.15,30.63 R23.2
N$28
  Top 0.254: R53.2 12.04,30.51 11.81,30.28 U5.29 11.82,27.54 11.53,27.25 10.57,27.25 9.7,26.39 J3.5
N$36
  Top 0.406: U12.6 32.35,4.99 L2.2
N$45
  Top 0.254: Q3.3 C25.2 2.3,21.99 2.95,21.34 7.45,21.34 U5.8
N$49
  Top 0.254: R43.2 19.05,20.19 R45.1 | R43.2 C34.1 | R43.2 20.37,20.19 20.7,19.86 21.72,19.86 U$5.3
N$52
  Top 0.254: C33.1 17.5,20.17 R44.1 R45.2
N$56
  Top 0.254: U5.7 6.02,22.61 5.69,22.94 5.69,25.48 5.5,25.67 Q3.1 C26.1
N$60
  Top 0.254: U13.1 R65.2
N$66
  Top 0.254: U5.15 14.22,21.29 13.92,21.59 12.47,21.59 12.22,21.84 12.22,23.39 J3.4
N$67
  Top 0.254: U5.17 15.32,21.81 14.78,22.35 J3.2
N$68
  Top 0.254: U5.16 15.02,21.36 14.2,22.17 13.77,22.17 13.56,22.38 13.56,24.64 J3.3
N$72  (via drill 0.41)
  Top 0.254: R70.1 v34.21,20.62 | U5.31 10.22,29.91 v9.68,30.45
  Bottom 0.254: v34.21,20.62 33.65,20.62 32.94,21.34 32.94,29.29 32.71,29.51 17.75,29.51 17.37,29.9 15.72,29.9 15.27,29.44 15.27,28.32 14.58,27.63 10.57,27.63 10.16,28.04 10.16,29.97 v9.68,30.45
N$97
  Top 0.254: U13.2 R70.2
NA_LPF1_OUT
  Top 0.254: U3.2 U3.1 C7.2 C6.2 26.55,22.25 25.7,22.25 25.2,22.76 R10.1
NA_LPF2_OUT
  Top 0.254: U3.15 U3.16 20.4,24.66 C11.2 C12.2 19.41,26.36 19.16,26.61 U5.23
PIN1
  Top 0.254: D1.A 28.22,6.92 L3.2
  Top 0.406: 30.02,5.14 L3.2
  pour Top (isolate 0.254, hatched): 26.47,7.72 26.44,7.72 26.44,5.54 30.05,5.54 30.05,7.72
V_AFTER_JFET
  Top 0.254: 1.86,3.16 Q1.3
  Top 0.305: 1.86,3.16 R27.1 1.86,6.06 2.39,6.58 7.98,6.58 8.58,7.19 9.27,7.19 9.55,7.47 9.55,9.98 9.8,10.24 11.01,10.24 U$1.8
V_COMPARATOR_IN  (via drill 0.41)
  Top 0.254: v14.35,1.42 11.91,1.42 U4.5 | v16.46,28.9 U5.25
  Bottom 0.254: v14.35,1.42 17.04,1.42 18.44,2.82 19.28,2.82 19.56,3.1 19.56,27.69 18.34,28.9 v16.46,28.9
V_CURRENTSOURCEOUT
  Top 0.254: R26.2 9.81,5.51 10.11,5.21 U4.8 11.94,5.16 R2.2 15.29,5.44 15.29,6.25 15.54,6.5 19.66,6.5 20.01,6.86 20.01,9.35 19.84,9.52 17.18,9.52 U1.1
V_MCU_PWM
  Top 0.254: U5.14 13.42,19.68 13.77,19.33 R44.2
V_MCU_VIN_CTRL  (via drill 0.41)
  Top 0.254: U$5.1 22.9,21.78 23.04,21.64 v23.04,20.83 23.04,20.01 23.19,19.86 24.32,19.86 U$5.4 | U1.3 16.17,8.16 15.98,8.36 15.98,10.31 16.33,10.67 17.02,10.67 v23.19,10.64
  Bottom 0.254: v23.19,10.64 23.19,20.68 v23.04,20.83
V_MIDSUPPLY  (via drill 0.41)
  Top 0.254: C22.1 25.59,12.38 U8.6 23.23,12.38 22.68,12.93 22.68,16.03 22.63,16.08 22.84,16.29 U7.6 25.59,16.29 C14.1 | U6.2 10.85,16.26 v11.33,15.77 | 22.94,17.2 22.91,17.22 21.92,17.22 20.83,18.31 19.28,18.31 19.08,18.11 R6.2 15.42,18.11 v15.29,17.98
  Top 0.406: 22.84,16.29 22.94,16.38 22.94,17.2 22.94,18.14 23.67,18.87 25.5,18.87 25.93,19.3 25.93,19.43 26.26,19.76 C36.1 27.61,19 28.22,18.39 U15.1
  Bottom 0.254: v11.33,15.77 12.01,15.77 14.22,17.98 v15.29,17.98
  pour Top (hatched): 22.05,17.2 23.34,17.2 23.37,13.26 21.69,13.26 21.67,17.17 22,17.17 22,17.14
V_SWREG_SHDN_MCU_PIN  (via drill 0.41)
  Top 0.254: U5.13 12.62,19.26 12.75,19.13 13.31,19.13 13.66,18.77 21.64,18.77 v21.72,18.85 | U2.4 24.5,1.94 v24.51,1.93
  Bottom 0.254: v21.72,18.85 20.35,17.47 20.35,10.49 21.95,8.89 23.77,8.89 24.16,8.51 24.16,7.06 23.82,6.73 21.67,6.73 21.28,6.35 21.28,2.92 22.28,1.93 v24.51,1.93
V_TOJFETLIMIT
  Top 0.254: 3.75,1.98 Q1.1 5.08,2.13 5.21,2.26 5.21,5.16 5.26,5.21 U4.1 8.92,5.21 9.27,5.56 9.27,6.27 R26.1
VCC  (via drill 0.41)
  Top 0.254: 8.56,25.01 U5.4 8.77,25.01 9.22,24.56 9.22,23.9 J3.6 8.04,23.42 7.98,23.36 U5.6 7.91,23.39 6.58,23.39 6.25,23.72 v6.25,28.37 6.12,28.5 C4.1 4.92,29.69 C13.1 4.92,30.32 5.82,31.22 13.16,31.22 v13.89,30.48 12.95,30.48 R53.1 | 18.04,22.61 C32.1 | 24.36,21.8 U$5.5 | C3.1 19.07,22.67 | U4.6 11.84,2.62 | U8.8 C21.1 27.25,13.66 27.51,13.92 27.51,15.95 | U7.8 24.43,17.61 C31.1 27.25,17.61 27.51,17.35 27.51,15.95 | 27.51,15.95 27.61,15.85 U15.3 | C9.1 32.04,22.78 32.01,22.81 | U6.13 15.27,14.93 16.07,14.93 16.43,15.29 16.96,15.29 C28.1 16.99,16.2 v17.6,16.81
  Top 0.305: v10.03,4.01 10.03,3.07 10.46,2.64 11.86,2.64 U4.6
  Top 0.406: U12.4 32.31,7.9 C76.1 C74.1 32.3,9.4 C79.2 | IC2.1 32.3,11.39 C79.2 | 32,15.72 32.3,15.43 32.3,12.61 v32.28,12.6 32.28,11.01 C79.2 | 32,15.72 31.88,15.85 | 31.88,15.85 U15.3 | 32.01,15.73 32,15.72 | v18.47,23.7 18.47,22.63 | 18.47,22.63 C3.1 | 18.47,22.63 C32.1 | 18.04,22.61 U5.18 | 19.07,22.67 C23.1 20.23,22.66 23.09,22.66 23.97,21.78 U$5.5 25.11,21.01 v25.68,21.01 | v25.4,26.59 U3.4 29.11,26.59 29.92,25.78 29.92,24.84 30.23,24.54 31.38,24.54 C8.1 32.01,22.81 32.01,15.99 31.88,15.85 | v14.2,8.64 14.86,9.3 14.86,10.14 C27.1
  Bottom 0.406: v18.47,23.7 18.47,17.68 v17.6,16.81 | v17.6,16.81 17.6,16.74 18.47,15.87 18.47,12.9 v14.2,8.64 13.36,8.64 13.36,5.26 12.12,4.01 v10.03,4.01 | v25.4,26.59 25.4,21.28 v25.68,21.01 | v17.6,16.81 17.55,16.87 17.55,17.7 14.07,21.18 11.94,21.18 J3.6
VDD_36V  (via drill 0.41)
  Top 0.406: 21.59,5.8 21.59,6.58 21.77,6.76 23.65,6.76 23.95,7.06 23.95,8.74 23.88,8.81 | 21.59,5.8 R3.1 | 21.59,5.8 21.59,3.87 CF.1 | 18.83,3.86 T1.3 | U1.7 23.88,8.81 | D1.C 26.82,10.74 26.12,10.04 C2.1 24.27,10.04 23.98,9.75 23.98,8.91 23.88,8.81 | U$1.4 8.4,8.22 v8.43,8.25
  Top 0.61: 21.59,3.87 18.74,3.87 T1.3 18.52,3.92 v18.52,5.05
  Bottom 0.406: v18.52,5.05 16.18,5.05 14.83,3.71 13.13,3.71 11.38,1.96 10.11,1.96 8.43,3.63 v8.43,8.25
VIN  (via drill 0.41)
  Top 0.406: U2.5 26.41,3.34 C1.1 28.11,3.32 L3.1 | L2.1 34.39,3.7 U12.1 35.66,5.03 | U12.3 35.66,6.35 35.66,5.03 | 35.66,5.03 36.7,5.03 C68.1
  Top 0.813: L2.1 34.19,3.41 34.19,2.31 33.78,1.9 v32.16,1.9 30.33,1.9 30.02,2.21 L3.1 | CN1.2 37.02,25.45 37.04,25.43 41.2,25.43 41.96,24.66 41.96,23.9 43.51,22.35 v43.51,5.61
  Bottom 0.813: v43.51,5.61 35.99,5.56 35.46,5.03 35.46,2.46 34.8,1.8 32.26,1.8 v32.16,1.9

### Text on the board
bNames: Na/Cl Sensing r2 / Designed by Eric Wu, / Allan Zhao, Sam Emaminejad / Javey Lab - SGTC